# EAGLE design M162A (EAGLE 6.6.0)
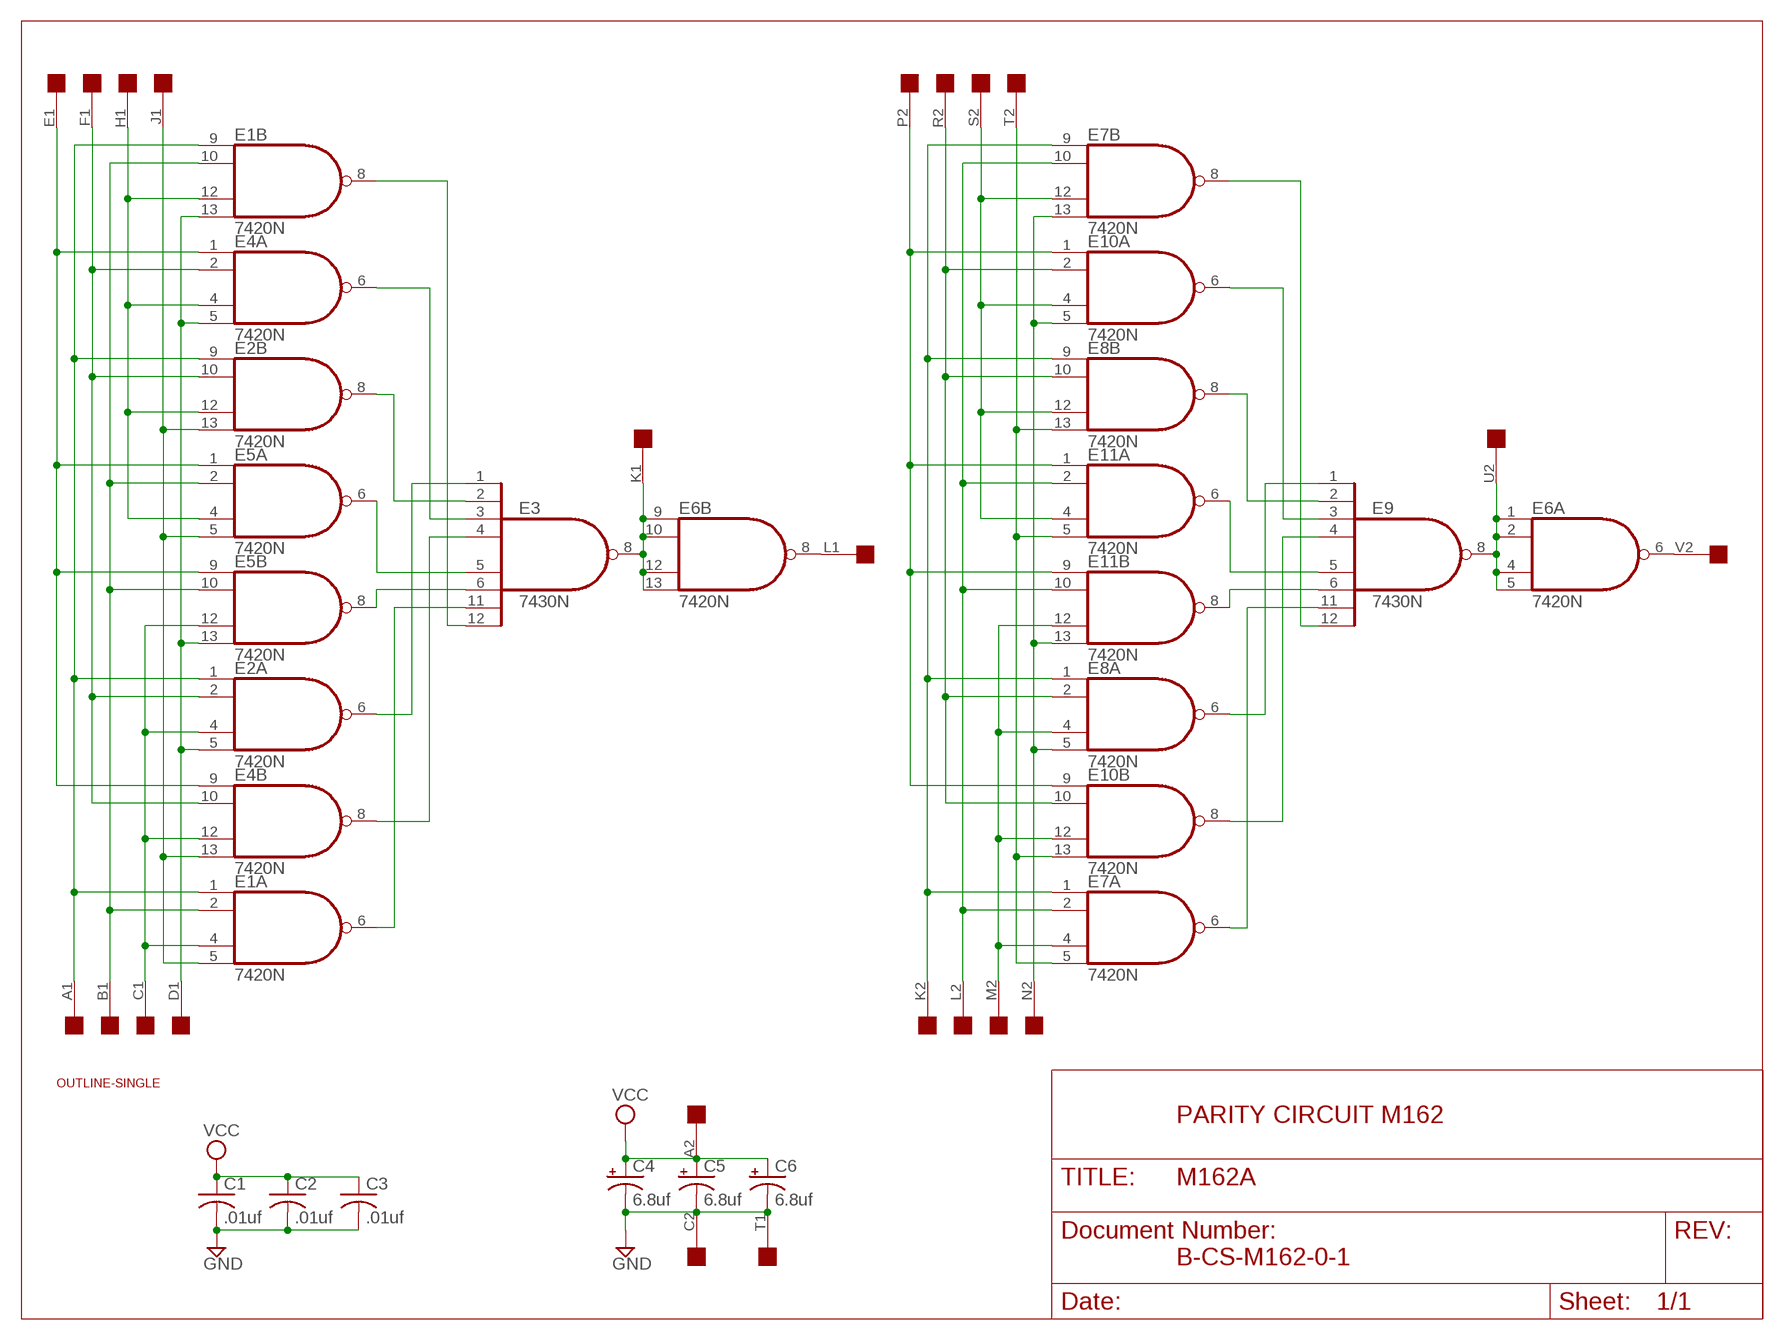
[diagram p0: schematic, sheet 1]

## Parts
C1  .01uf  C-US075-032X103  [C075-032X103]
C2  .01uf  C-US075-032X103  [C075-032X103]
C3  .01uf  C-US075-032X103  [C075-032X103]
C4  6.8uf  CPOL-USE15-5AXIAL  [E15-5]
C5  6.8uf  CPOL-USE15-5AXIAL  [E15-5]
C6  6.8uf  CPOL-USE15-5AXIAL  [E15-5]
E1  7420N  74S20N  [DIL14]
E2  7420N  74S20N  [DIL14]
E3  7430N  [DIL14]
E4  7420N  74S20N  [DIL14]
E5  7420N  74S20N  [DIL14]
E6  7420N  74S20N  [DIL14]
E7  7420N  74S20N  [DIL14]
E8  7420N  74S20N  [DIL14]
E9  7430N  [DIL14]
E10  7420N  74S20N  [DIL14]
E11  7420N  74S20N  [DIL14]
U$1  OUTLINE-SINGLE  [SINGLE]
U$2  EDGE-2CONNECTOR  [EDGE-CON2]

## Nets
GND [Supply]: C1.2 C2.2 C3.2 C4.- C5.- C6.- U$2.C2 U$2.T1
N$1: E1.4(A:I2) E2.4(A:I2) E4.12(B:I2) E5.12(B:I2) U$2.C1
N$2: E1.13(B:I3) E2.5(A:I3) E4.5(A:I3) E5.13(B:I3) U$2.D1
N$3: E3.4(I3) E4.8(B:O)
N$4: E1.12(B:I2) E2.12(B:I2) E4.4(A:I2) E5.4(A:I2) U$2.H1
N$5: E2.2(A:I1) E2.10(B:I1) E4.2(A:I1) E4.10(B:I1) U$2.F1
N$6: E1.2(A:I1) E1.10(B:I1) E5.2(A:I1) E5.10(B:I1) U$2.B1
N$7: E7.12(B:I2) E8.12(B:I2) E10.4(A:I2) E11.4(A:I2) U$2.S2
N$8: E1.1(A:I0) E1.9(B:I0) E2.1(A:I0) E2.9(B:I0) U$2.A1
N$9: E1.8(B:O) E3.12(I7)
N$10: E3.3(I2) E4.6(A:O)
N$11: E7.6(A:O) E9.11(I6)
N$12: E3.5(I4) E5.6(A:O)
N$13: E3.6(I5) E5.8(B:O)
N$14: E2.6(A:O) E3.1(I0)
N$15: E1.6(A:O) E3.11(I6)
N$16: E2.8(B:O) E3.2(I1)
N$17: E3.8(O) E6.9(B:I0) E6.10(B:I1) E6.12(B:I2) E6.13(B:I3) U$2.K1
N$18: E7.2(A:I1) E7.10(B:I1) E11.2(A:I1) E11.10(B:I1) U$2.L2
N$19: E7.13(B:I3) E8.5(A:I3) E10.5(A:I3) E11.13(B:I3) U$2.N2
N$20: E10.1(A:I0) E10.9(B:I0) E11.1(A:I0) E11.9(B:I0) U$2.P2
N$21: E8.2(A:I1) E8.10(B:I1) E10.2(A:I1) E10.10(B:I1) U$2.R2
N$24: E8.8(B:O) E9.2(I1)
N$25: E7.5(A:I3) E8.13(B:I3) E10.13(B:I3) E11.5(A:I3) U$2.T2
N$26: E7.8(B:O) E9.12(I7)
N$27: E9.3(I2) E10.6(A:O)
N$29: E9.5(I4) E11.6(A:O)
N$30: E9.6(I5) E11.8(B:O)
N$33: E9.4(I3) E10.8(B:O)
N$34: E6.1(A:I0) E6.2(A:I1) E6.4(A:I2) E6.5(A:I3) E9.8(O) U$2.U2
N$35: E6.6(A:O) U$2.V2
N$36: E6.8(B:O) U$2.L1
N$37: E1.5(A:I3) E2.13(B:I3) E4.13(B:I3) E5.5(A:I3) U$2.J1
N$86: E4.1(A:I0) E4.9(B:I0) E5.1(A:I0) E5.9(B:I0) U$2.E1
N$109: E7.4(A:I2) E8.4(A:I2) E10.12(B:I2) E11.12(B:I2) U$2.M2
N$113: E7.1(A:I0) E7.9(B:I0) E8.1(A:I0) E8.9(B:I0) U$2.K2
S$14: E8.6(A:O) E9.1(I0)
VCC [Supply]: C1.1 C2.1 C3.1 C4.+ C5.+ C6.+ U$2.A2
Unconnected: E1.3(3:NC) E1.11(11:NC) E2.3(3:NC) E2.11(11:NC) E4.3(3:NC) E4.11(11:NC) E5.3(3:NC) E5.11(11:NC) E6.3(3:NC) E6.11(11:NC) E7.3(3:NC) E7.11(11:NC) E8.3(3:NC) E8.11(11:NC) E10.3(3:NC) E10.11(11:NC) E11.3(3:NC) E11.11(11:NC) U$2.B2 U$2.D2 U$2.E2 U$2.F2 U$2.H2 U$2.J2 U$2.M1 U$2.N1 U$2.P1 U$2.R1 U$2.S1 U$2.U1 U$2.V1

## Notes on the sheet
- PARITY CIRCUIT M162
- B-CS-M162-0-1

## Power pins joined to a net without a drawn wire
GND: E1.7(P:GND) E2.7(P:GND) E3.7(GND) E4.7(P:GND) E5.7(P:GND) E6.7(P:GND) E7.7(P:GND) E8.7(P:GND) E9.7(GND) E10.7(P:GND) E11.7(P:GND)
VCC: E1.14(P:VCC) E2.14(P:VCC) E3.14(VCC) E4.14(P:VCC) E5.14(P:VCC) E6.14(P:VCC) E7.14(P:VCC) E8.14(P:VCC) E9.14(VCC) E10.14(P:VCC) E11.14(P:VCC)

## Library data of the parts
C1-C3 = rcl:C-US: CAPACITOR, American symbol
C4-C6 = dec-con:CPOL-USE15-5AXIAL: 0.6" veresion of an electrolytic
E1 E2 E4-E8 E10 E11 = dec-con:74*20: Dual 4-input NAND gate
E3 E9 = 74xx-us:74*30: 8-input NAND gate
U$1 = dec-con:OUTLINE-*: Board outlines for DEC boards.
U$2 = dec-con:EDGE-2: Double-Sided DEC edge connector.

## Net classes
1 Supply: width 0.813 mm

## Board
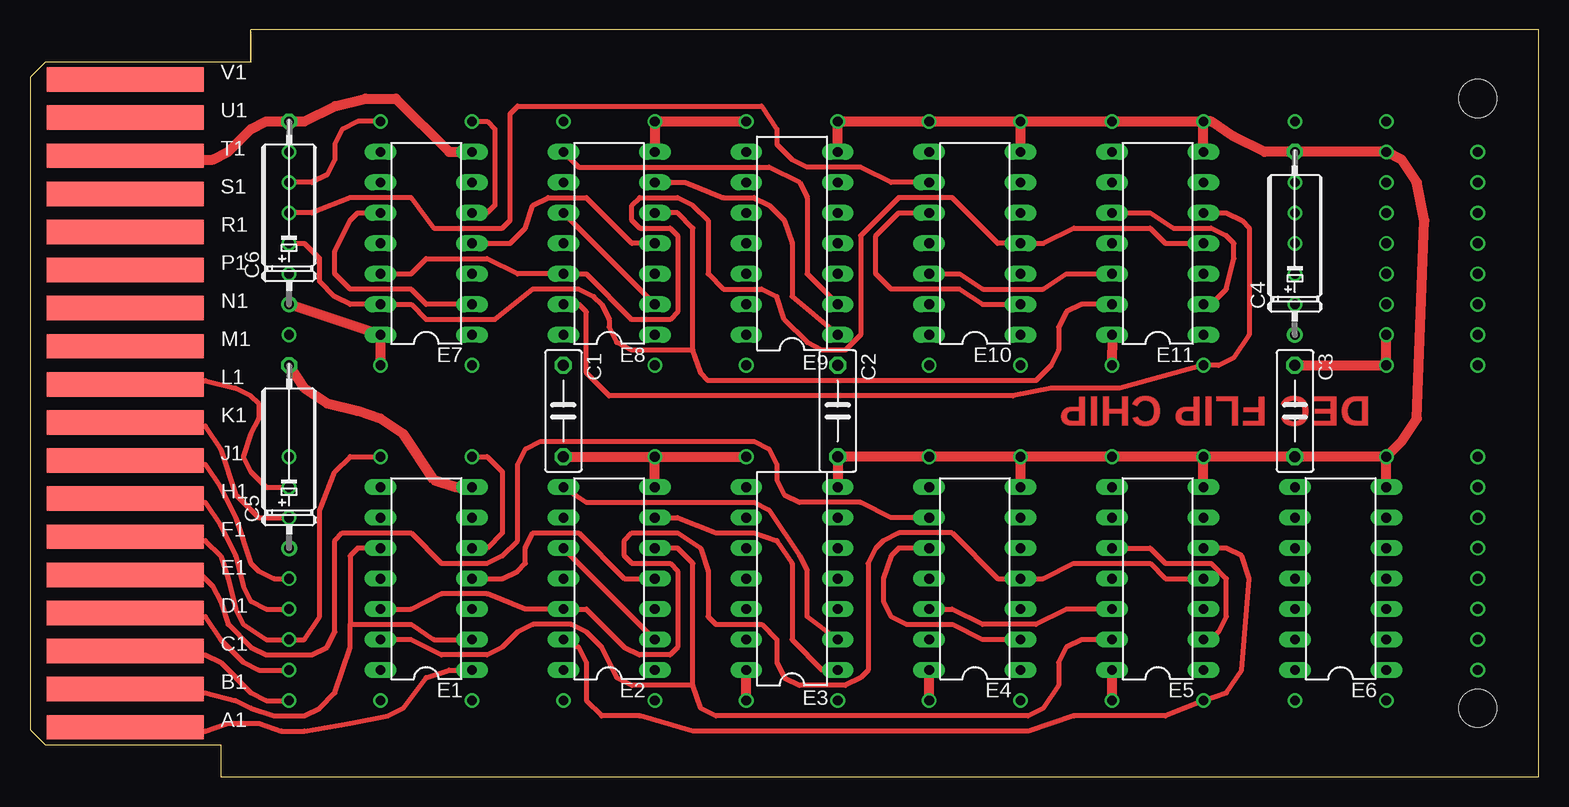
[diagram p1: board, top side]
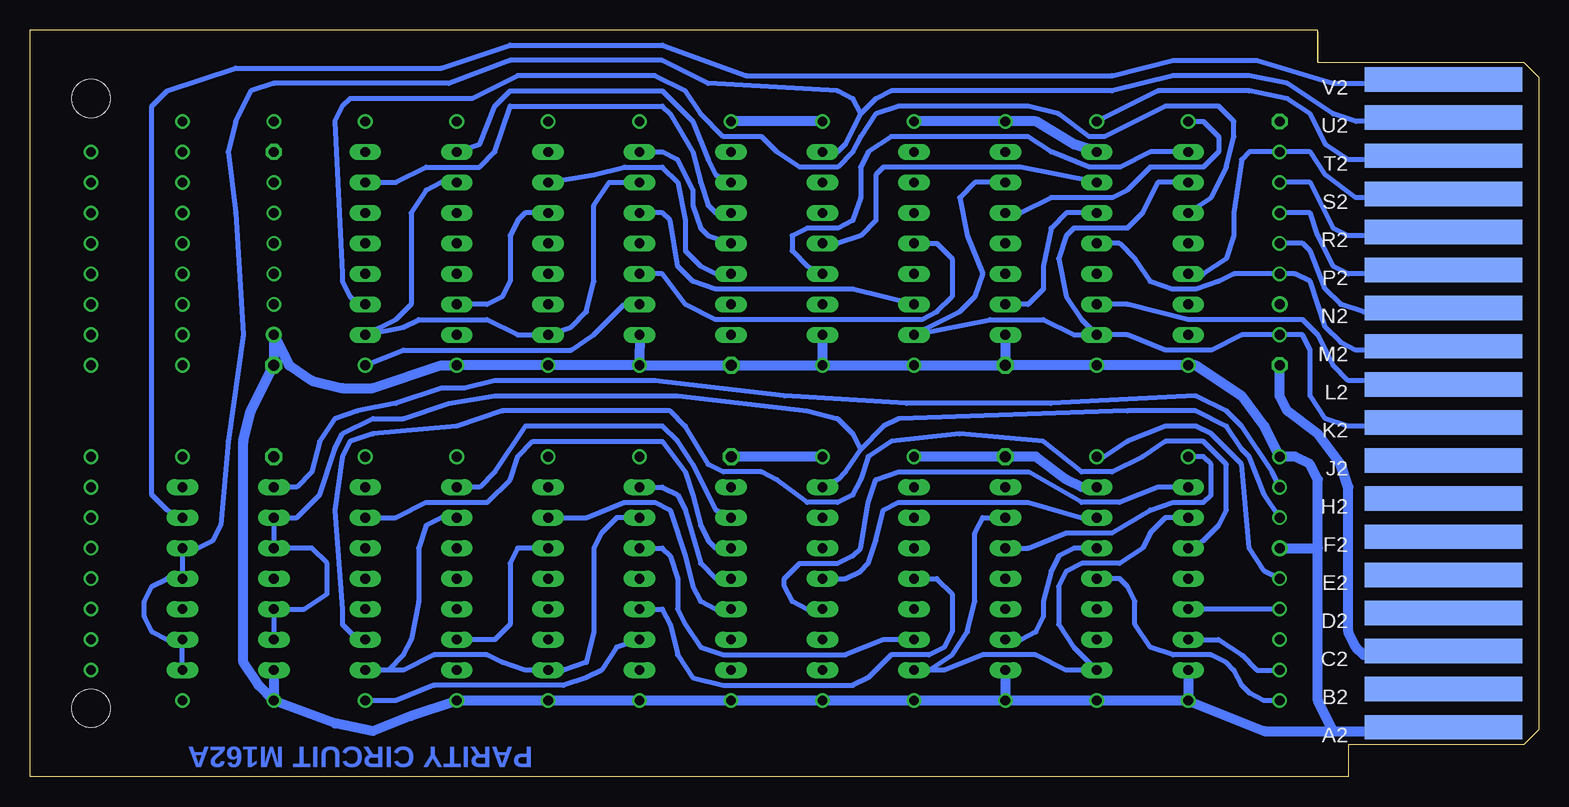
[diagram p2: board, bottom side, seen from below]

Size 125.73 x 62.23 mm. Coordinates in mm from the lower left corner, seen from the top.
Copper layers (1+16): Top 0.035mm / dielectric 1.5mm / Bottom 0.035mm
Design rules "16mils": minimum track width 16mil, minimum drill 32mil, track to track 15mil, track to pad 10mil, pad to pad 10mil, via to via 10mil, smd to smd 10mil, copper to edge 13mil, drill to drill 10mil, minimum pad ring 10mil, minimum via ring 8mil, stop-mask expansion 0mil, vias tented up to drill 0mil, thermal gap 10mil

### Footprints (pad centres in the part's own frame; a part is rotated, then mirrored left to right if it is on the bottom)
C075-032X103 = drill 0.914 octagon: 1 -3.81,0; 2 3.81,0
E15-5 = drill 0.813: + -7.62,0 | drill 0.813 octagon: - 7.62,0
DIL14 = drill 0.813 long: 1 -7.62,-3.81; 2 -5.08,-3.81; 3 -2.54,-3.81; 4 0,-3.81; 5 2.54,-3.81; 6 5.08,-3.81; 7 7.62,-3.81; 8 7.62,3.81; 9 5.08,3.81; 10 2.54,3.81; 11 0,3.81; 12 -2.54,3.81; 13 -5.08,3.81; 14 -7.62,3.81
SINGLE = hole 3.175: 120.65,56.515; 120.65,5.715
EDGE-CON2 = smd 13.106 x 2.032: A1 7.938,4.128; B1 7.938,7.303; C1 7.938,10.477; D1 7.938,13.652; E1 7.938,16.828; F1 7.938,20.003; H1 7.938,23.177; J1 7.938,26.352; K1 7.938,29.527; L1 7.938,32.703; M1 7.938,35.877; N1 7.938,39.053; P1 7.938,42.227; R1 7.938,45.403; S1 7.938,48.578; T1 7.938,51.752; U1 7.938,54.928; V1 7.938,58.102 | smd 13.106 x 2.032 bottom: A2 7.938,4.128; B2 7.938,7.303; C2 7.938,10.477; D2 7.938,13.652; E2 7.938,16.828; F2 7.938,20.003; H2 7.938,23.177; J2 7.938,26.352; K2 7.938,29.527; L2 7.938,32.703; M2 7.938,35.877; N2 7.938,39.053; P2 7.938,42.227; R2 7.938,45.403; S2 7.938,48.578; T2 7.938,51.752; U2 7.938,54.928; V2 7.938,58.102

### Placement (x,y rotation side)
C1  44.45,30.48 270 top
C2  67.31,30.48 270 top
C3  105.41,30.48 270 top
C4  105.41,44.45 90 top
C5  21.59,26.67 90 top
C6  21.59,46.99 90 top
E1  33.02,16.51 90 top
E2  48.26,16.51 90 top
E3  63.5,16.51 90 top
E4  78.74,16.51 90 top
E5  93.98,16.51 90 top
E6  109.22,16.51 90 top
E7  33.02,44.45 90 top
E8  48.26,44.45 90 top
E9  63.5,44.45 90 top
E10  78.74,44.45 90 top
E11  93.98,44.45 90 top
U$1  0,0 0 top
U$2  0,0 0 top

### Tracks (layer width: path | path; a pad name or v marks a point on that pad's centre or on a via)
GND  (via drill 0.81)
  Top 0.813: C5.- 22.86,32.38 24.77,31.11 27.31,30.48 29.21,29.84 31.12,28.57 33.66,24.77 35.56,24.13 E1.7 | C1.2 v52.07,26.67 | v52.07,26.67 v59.69,26.67 | E2.7 v52.07,26.67 | E3.7 C2.2 v74.93,26.67 v82.55,26.67 | E5.7 v97.79,26.67 | v97.79,26.67 v90.17,26.67 v82.55,26.67 | E4.7 v82.55,26.67 | E6.7 v113.03,26.67 | v113.03,26.67 C3.2 v97.79,26.67 | v113.03,26.67 114.3,27.94 115.57,29.84 116.21,46.35 115.57,49.53 114.3,51.44 v113.03,52.07 C4.- 102.87,52.07 100.33,53.34 98.43,54.61 v97.79,54.61 | E9.7 v67.31,54.61 v74.93,54.61 v82.55,54.61 | v82.55,54.61 v90.17,54.61 v97.79,54.61 | U$2.T1 9.53,51.44 15.24,51.44 16.51,52.07 18.42,53.98 19.69,54.61 C6.- 22.86,54.61 25.4,55.88 27.94,56.52 30.48,56.52 34.93,52.07 E7.7 | E8.7 v52.07,54.61 v59.69,54.61 | E10.7 v82.55,54.61 | E11.7 v97.79,54.61
  Bottom 0.813: U$2.C2 10.16,10.16 14.61,10.16 15.24,10.79 15.88,12.06 15.88,24.13 16.51,26.04 18.42,28.57 20.96,30.48 21.59,31.75 C5.- | E1.7 38.1,24.13 39.37,24.77 41.91,26.67 C1.2 v52.07,26.67 | v59.69,26.67 C2.2 | E7.7 38.74,52.7 41.91,54.61 v44.45,54.61 v52.07,54.61 | v59.69,54.61 v67.31,54.61
N$1  (via drill 0.81)
  Top 0.406: v21.59,6.35 19.69,6.35 18.42,6.99 15.88,9.53 14.61,10.16 8.89,10.16 U$2.C1 | E1.4 39.37,16.51 40.64,17.14 41.28,17.78 41.28,19.05 41.91,20.32 45.72,20.32 49.53,16.51 E2.4 | E4.12 76.84,13.97 79.38,12.7 83.82,12.7 86.36,13.97 E5.12
  Bottom 0.406: v21.59,6.35 22.86,6.35 24.13,6.99 24.77,7.62 25.4,8.89 26.04,9.53 27.31,10.16 30.48,10.16 32.39,10.79 33.66,12.7 33.66,14.61 34.29,15.88 34.93,16.51 E1.4 | E2.4 50.17,16.51 48.9,15.24 48.9,12.06 49.53,10.79 50.8,10.16 53.98,10.16 55.88,8.26 57.15,7.62 67.95,7.62 70.49,8.26 71.76,10.16 72.39,12.7 73.03,13.97 E4.12
N$2  (via drill 0.81)
  Top 0.406: E5.13 87.63,11.43 86.36,10.79 85.73,9.53 85.73,7.62 84.46,5.71 83.19,5.08 57.15,5.08 55.88,5.71 55.25,7.62 | 55.25,7.62 50.17,7.62 48.9,8.26 47.63,10.79 46.36,12.06 45.09,12.7 41.91,12.7 40.64,12.06 39.37,10.79 38.1,10.16 34.29,10.16 31.75,11.43 E1.13 | 55.25,7.62 55.25,17.78 53.98,19.05 E2.5 | v21.59,8.89 19.05,8.89 17.78,9.53 15.88,11.43 14.61,13.34 8.26,13.34 U$2.D1
  Bottom 0.406: E4.5 85.09,19.05 85.73,17.78 85.73,12.7 87,11.43 E5.13 | E1.13 26.67,11.43 24.77,10.16 23.5,8.89 v21.59,8.89
N$3
  Bottom 0.406: E4.8 73.03,24.13 71.76,23.5 71.12,22.23 69.85,17.78 68.58,16.51 E3.4
N$4  (via drill 0.81)
  Top 0.406: U$2.H1 9.53,22.86 14.61,22.86 15.88,20.95 17.15,18.41 17.78,15.88 18.42,14.61 19.69,13.97 v21.59,13.97 | E1.12 31.75,13.97 34.29,15.24 38.1,15.24 41.28,13.97 E2.12 46.36,13.97 49.53,10.79 50.8,10.16 53.34,10.16 53.98,10.79 53.98,17.14 53.34,17.78 50.17,17.78 49.53,18.41 49.53,19.68 50.17,20.32 53.98,20.32 55.88,19.05 56.52,17.14 56.52,13.34 57.15,12.7 60.96,12.7 62.23,11.43 62.23,9.53 62.87,8.26 64.14,7.62 67.95,7.62 69.22,8.26 69.85,8.89 69.85,17.78 70.49,19.05 71.12,19.68 72.39,20.32 76.84,20.32 80.65,16.51 E4.4 84.46,16.51 87,17.78 93.35,17.78 94.62,16.51 E5.4
  Bottom 0.406: v21.59,13.97 E1.12
N$5  (via drill 0.81)
  Top 0.406: U$2.F1 8.89,19.68 14.61,19.68 15.88,18.41 16.51,16.51 17.15,13.97 17.78,12.7 19.69,11.43 v21.59,11.43 22.86,11.43 24.13,13.34 24.13,22.23 25.4,25.4 26.67,26.67 v29.21,26.67 | E4.10 72.39,19.05 71.76,18.41 71.12,16.51 71.12,14.61 71.76,13.34 73.03,12.7 76.84,12.7 79.38,11.43 E4.2 | E2.10 E2.2
  Bottom 0.406: E2.10 42.55,19.05 39.37,20.32 35.56,20.32 32.39,22.23 30.48,22.86 27.94,22.86 27.31,23.5 27.31,26.04 27.94,26.67 v29.21,26.67 | E4.10 73.03,19.05 72.39,18.41 71.76,16.51 71.76,13.97 71.12,12.7 69.85,10.79 67.95,10.16 57.79,10.16 54.61,11.43 E2.2
N$6
  Top 0.406: 26.67,12.7 26.67,10.79 25.4,6.99 24.13,5.71 22.86,5.08 20.32,5.08 18.42,5.71 17.15,6.35 14.61,6.99 8.26,6.99 U$2.B1 | 26.67,12.7 31.75,12.7 33.66,11.43 E1.2 | E1.10 27.31,19.05 26.67,18.41 26.67,12.7 | E5.2 98.43,11.43 99.06,12.06 99.7,13.34 99.7,16.51 98.43,17.78 94.62,17.78 93.35,19.05 E5.10
  Bottom 0.406: E1.10 27.94,19.68 26.67,20.95 26.04,22.23 26.04,26.04 27.94,27.94 31.12,27.94 33.02,26.67 35.56,25.4 38.1,25.4 41.28,27.94 48.26,28.57 53.98,27.94 55.88,26.67 56.52,24.77 57.15,23.5 58.42,22.86 60.96,22.86 63.5,24.77 64.77,25.4 67.95,25.4 69.22,26.04 71.12,29.21 72.39,30.48 86.36,30.48 90.17,29.21 97.16,28.57 99.06,27.94 99.7,26.67 100.33,22.23 99.7,13.97 99.7,12.7 98.43,11.43 E5.2
N$7  (via drill 0.81)
  Top 0.406: E7.12 31.75,41.91 33.02,43.18 38.1,43.18 40.64,41.91 E8.12 46.36,41.91 50.17,38.1 53.34,38.1 53.98,38.73 53.98,45.09 53.34,45.72 50.8,45.72 50.17,46.35 50.17,47.62 50.8,48.26 53.98,48.26 55.25,47.62 56.52,46.35 56.52,41.91 57.79,40.64 60.96,40.64 62.23,40.01 62.87,38.1 64.77,36.2 66.04,35.56 67.95,35.56 69.22,36.83 69.22,45.09 72.39,48.26 76.84,48.26 80.65,44.45 E10.4 84.46,44.45 87,45.72 93.35,45.72 94.62,44.45 E11.4
  Bottom 0.406: U$2.S2 8.89,48.26 15.24,48.26 17.78,50.16 19.05,52.07 v21.59,52.07 24.13,52.07 24.77,51.44 25.4,46.99 25.4,45.09 26.04,43.18 27.94,41.91 E7.12
N$8
  Top 0.406: E1.1 34.93,8.89 33.02,8.26 31.12,5.71 29.85,5.08 26.67,4.45 22.86,3.81 20.96,3.81 19.05,4.45 16.51,4.45 14.61,3.81 8.26,3.81 U$2.A1
  Bottom 0.406: E1.9 31.12,21.59 32.39,20.32 33.02,19.05 34.93,17.78 38.1,17.78 39.37,17.14 40.01,15.88 40.01,12.7 38.74,10.79 E1.1 39.37,8.89 41.91,10.16 46.36,10.16 49.53,8.89 50.8,8.89 | E2.1 50.8,8.89 | 50.8,8.89 48.9,10.16 47.63,12.06 46.99,14.61 46.99,20.32 46.36,21.59 E2.9
N$9
  Bottom 0.406: E3.12 60.96,13.97 62.23,14.61 62.87,15.88 62.87,16.51 61.6,17.78 58.42,17.78 57.15,18.41 56.52,19.05 55.88,22.86 55.25,24.77 53.34,25.4 42.55,25.4 38.1,22.86 34.93,22.86 31.75,24.13 E1.8
N$10
  Bottom 0.406: E4.6 79.38,21.59 76.2,22.86 73.66,22.86 72.39,22.23 71.12,18.41 70.49,15.88 69.85,14.61 68.58,13.97 E3.3
N$11
  Bottom 0.406: E9.11 58.42,44.45 56.52,45.09 55.25,46.35 55.25,50.16 54.61,50.8 43.18,50.8 E7.6
N$12
  Bottom 0.406: E5.6 95.25,21.59 92.71,22.86 87.63,22.86 85.73,24.77 85.09,26.67 83.82,27.94 73.03,27.94 71.12,25.4 70.49,23.5 69.85,20.95 69.22,19.68 68.58,19.05 E3.5
N$13
  Bottom 0.406: E3.6 68.58,22.23 69.85,24.77 70.49,26.04 71.76,27.94 73.03,29.21 84.46,29.21 87,25.4 88.27,24.13 E5.8
N$14
  Top 0.406: E2.6 53.98,21.59 57.15,20.32 60.33,20.32 62.23,19.68 63.5,17.78 63.5,11.43 66.04,8.89 E3.1
N$15
  Bottom 0.406: E3.11 57.79,16.51 56.52,17.14 55.88,17.78 55.25,19.68 54.61,22.23 53.34,22.86 42.55,22.86 38.1,21.59 E1.6
N$16
  Top 0.406: E2.8 46.36,22.86 60.33,22.86 61.6,22.23 64.14,18.41 64.77,17.14 64.77,13.34 E3.2
N$17  (via drill 0.81)
  Top 0.406: U$2.K1 10.16,29.21 14.61,29.21 15.88,27.3 17.15,23.5 19.05,21.59 v21.59,21.59
  Bottom 0.406: v21.59,21.59 22.86,23.5 24.13,26.67 24.77,27.3 26.04,29.21 28.58,30.48 34.29,30.48 53.34,29.84 54.61,29.21 56.52,27.3 | 56.52,27.3 57.79,25.4 58.42,24.77 E3.8 | 56.52,27.3 57.15,28.57 58.42,29.84 60.96,30.48 71.76,31.75 87,31.75 90.81,31.11 94.62,29.84 97.16,29.84 99.7,28.57 100.33,27.3 101.6,23.5 103.51,21.59 E6.9 E6.10 102.24,19.05 100.97,17.78 100.97,15.24 102.87,13.97 E6.12 E6.13
N$18
  Top 0.406: E11.2 98.43,39.37 99.7,40.64 100.33,43.18 100.33,44.45 99.7,45.09 98.43,45.72 95.25,45.72 93.35,46.99 E11.10 | E7.10 27.31,46.99 26.67,46.35 25.4,43.81 25.4,41.91 26.67,40.64 31.75,40.64 33.02,39.37 E7.2
  Bottom 0.406: E7.10 27.31,48.26 26.04,50.8 25.4,53.34 25.4,54.61 26.67,55.88 31.12,55.88 36.2,53.34 37.47,53.34 40.01,55.24 42.55,55.88 53.34,55.88 55.25,55.24 56.52,53.34 57.15,52.07 58.42,50.8 61.6,50.8 63.5,52.07 64.77,53.34 67.95,53.34 69.85,55.24 71.12,57.15 73.66,58.42 85.09,58.42 88.9,56.52 99.06,56.52 99.7,55.88 100.33,54.61 99.7,41.91 99.7,41.27 99.06,40.01 98.43,39.37 E11.2 | U$2.L2 8.89,33.02 15.88,33.02 17.15,34.29 18.42,36.83 19.69,38.1 29.21,38.1 34.29,39.37 E7.2
N$19  (via drill 0.81)
  Top 0.406: v21.59,44.45 22.86,44.45 24.13,43.18 24.13,41.27 25.4,40.01 26.67,39.37 E7.13 31.75,39.37 33.02,38.1 38.74,38.1 41.91,40.64 45.72,40.64 46.99,40.01 47.63,39.37 48.26,38.1 48.26,37.47 48.9,36.2 50.17,35.56 55.25,35.56 | E11.13 87.63,39.37 86.36,38.73 85.73,37.47 85.73,35.56 85.09,34.29 83.82,33.02 56.52,33.02 55.88,33.66 55.25,35.56 | 55.25,35.56 55.25,45.72 53.98,46.99 E8.5
  Bottom 0.406: U$2.N2 8.89,38.73 14.61,38.73 16.51,39.37 17.78,40.64 19.05,43.81 19.69,44.45 v21.59,44.45 | E10.5 84.46,46.99 85.09,46.35 85.73,45.09 85.73,41.27 86.36,40.01 87.63,39.37 E11.13
N$20  (via drill 0.81)
  Top 0.406: E10.9 71.76,49.53 69.22,50.8 64.77,50.8 63.5,51.44 62.23,52.7 62.23,53.98 60.96,55.88 40.64,55.88 40.01,55.24 40.01,46.35 39.37,45.72 33.66,45.72 31.75,48.26 26.67,48.26 23.5,46.99 v21.59,46.99
  Bottom 0.406: E11.9 91.44,49.53 92.71,48.9 93.98,46.99 93.98,39.37 95.25,38.1 E11.1 94.62,37.47 93.35,38.1 87.63,38.1 85.09,36.83 E10.1 80.65,37.47 79.38,38.73 78.74,41.27 78.74,47.62 77.47,49.53 E10.9 | U$2.P2 8.89,41.91 15.88,41.91 17.15,42.55 18.42,45.09 19.05,46.99 v21.59,46.99
N$21  (via drill 0.81)
  Top 0.406: v29.21,54.61 27.31,54.61 26.04,53.98 25.4,52.7 25.4,51.44 24.77,50.16 23.5,49.53 v21.59,49.53 | E10.10 72.39,46.99 70.49,45.09 70.49,41.91 71.76,40.64 77.47,40.64 79.38,39.37 E10.2 | E8.2 E8.10
  Bottom 0.406: v29.21,54.61 27.94,54.61 26.67,53.34 26.67,52.07 27.94,50.8 32.39,50.8 34.29,48.9 35.56,48.26 40.64,48.26 43.18,46.99 E8.10 | U$2.R2 8.89,45.09 15.88,45.09 17.15,45.72 19.05,49.53 v21.59,49.53 | E8.2 57.15,40.64 68.58,40.64 70.49,41.27 71.76,42.55 72.39,46.35 73.03,46.99 E10.10
N$24
  Top 0.406: E8.8 45.72,50.8 61.6,50.8 64.14,49.53 64.77,48.26 64.77,41.91 E9.2
N$25  (via drill 0.81)
  Top 0.406: v36.83,54.61 38.1,54.61 38.74,53.98 38.74,47.62 38.1,46.99 E7.5 | E11.5 99.7,46.99 100.97,46.35 101.6,45.72 101.6,36.83 100.33,34.92 99.06,34.29 v97.79,34.29 90.81,32.38 85.09,32.38 81.92,31.75 48.26,31.75 46.36,33.66 46.36,38.73 45.72,39.37 E8.13
  Bottom 0.406: E7.5 39.37,46.99 40.64,45.72 41.28,42.55 41.28,40.64 42.55,39.37 E8.13 | U$2.T2 9.53,51.44 15.88,51.44 17.78,52.7 19.05,55.24 20.96,56.52 24.13,57.15 31.75,57.15 v36.83,54.61 | v97.79,34.29 94.62,35.56 80.65,35.56 78.74,36.83 76.2,39.37 E10.13
N$26
  Bottom 0.406: E7.8 32.39,52.07 34.93,50.8 37.47,50.8 40.64,52.07 42.55,53.34 53.98,53.34 55.88,52.07 56.52,50.8 56.52,48.26 57.15,46.35 58.42,45.72 60.96,45.72 62.23,45.09 62.23,43.81 60.96,42.55 E9.12
N$27
  Bottom 0.406: E10.6 78.74,50.16 76.2,50.8 73.03,50.8 71.76,49.53 71.12,46.35 71.12,43.81 69.85,42.55 68.58,41.91 E9.3
N$29
  Bottom 0.406: E11.6 95.25,49.53 92.71,50.8 88.27,50.8 87,52.07 85.73,55.88 73.03,55.88 72.39,55.24 70.49,52.07 69.85,49.53 69.22,47.62 68.58,46.99 E9.5
N$30
  Bottom 0.406: E11.8 88.27,52.7 87,55.88 85.73,57.15 73.03,57.15 70.49,54.61 69.22,51.44 68.58,50.16 E9.6
N$33
  Bottom 0.406: E10.8 73.03,52.07 71.76,51.44 70.49,48.9 70.49,47.62 69.85,45.72 69.22,45.09 E9.4
N$34
  Bottom 0.406: E6.1 E6.2 114.3,11.43 115.57,12.06 116.21,13.34 116.21,14.61 115.57,15.88 114.3,16.51 E6.4 E6.5 111.76,19.05 110.49,19.68 109.86,20.95 109.22,27.94 107.95,36.83 108.59,46.99 109.22,52.07 108.59,54.61 107.32,57.15 105.41,57.78 90.81,57.78 85.73,59.69 73.03,59.69 69.22,57.78 58.42,57.15 57.15,56.52 56.52,55.24 | U$2.U2 8.89,54.61 15.24,54.61 17.15,55.24 20.96,57.78 24.13,58.42 30.48,58.42 35.56,57.15 53.98,57.15 55.25,56.52 56.52,55.24 | 56.52,55.24 57.79,52.7 58.42,52.07 E9.8
N$35
  Bottom 0.406: E6.6 114.3,22.23 115.57,23.5 115.57,55.88 114.3,57.15 108.59,59.05 91.44,59.05 85.73,60.96 73.03,60.96 66.04,58.42 35.56,58.42 30.48,59.69 23.5,59.69 17.15,57.78 8.89,57.78 U$2.V2
N$36  (via drill 0.81)
  Top 0.406: U$2.L1 10.16,33.02 14.61,33.02 17.15,32.38 18.42,31.75 19.05,31.11 19.05,29.84 18.42,28.57 17.78,26.67 18.42,25.4 19.69,24.13 v21.59,24.13
  Bottom 0.406: v21.59,24.13 22.23,25.4 24.77,29.21 26.04,30.48 28.58,31.75 40.64,31.11 52.71,31.11 62.87,31.75 73.66,33.02 87,33.02 89.54,32.38 91.44,32.38 95.25,31.11 98.43,30.48 100.33,29.84 101.6,27.94 102.24,25.4 103.51,24.13 E6.8
N$37  (via drill 0.81)
  Top 0.406: U$2.J1 8.89,26.04 14.61,26.04 15.88,24.13 17.15,21.59 18.42,17.78 19.05,17.14 20.32,16.51 v21.59,16.51 | v36.83,26.67 38.1,26.67 39.37,25.4 39.37,20.32 38.1,19.05 E1.5 | E5.5 99.7,19.05 100.97,18.41 101.6,16.51 100.97,8.89 99.7,6.99 v97.79,6.35 94.62,5.08 87,5.08 83.19,3.81 55.25,3.81 50.8,5.08 47.63,5.08 46.36,6.35 46.36,9.53 45.72,10.79 E2.13
  Bottom 0.406: E1.5 38.74,19.05 40.01,18.41 40.64,17.14 41.28,14.61 41.28,13.34 41.91,12.06 43.18,11.43 E2.13 | v21.59,16.51 22.86,17.14 24.13,19.05 24.77,26.04 27.31,28.57 28.58,29.21 31.12,29.21 34.29,27.94 36.2,26.67 v36.83,26.67 | E4.13 76.84,10.79 78.11,8.89 79.38,8.26 81.28,7.62 92.08,7.62 95.25,6.35 v97.79,6.35
N$57  (via drill 0.81)
  other vias: 113.03,39.37
N$58  (via drill 0.81)
  other vias: 113.03,41.91
N$59  (via drill 0.81)
  other vias: 113.03,44.45
N$60  (via drill 0.81)
  other vias: 113.03,46.99
N$61  (via drill 0.81)
  other vias: 113.03,49.53
N$62  (via drill 0.81)
  other vias: 105.41,39.37
N$63  (via drill 0.81)
  other vias: 105.41,41.91
N$64  (via drill 0.81)
  other vias: 105.41,44.45
N$65  (via drill 0.81)
  other vias: 105.41,46.99
N$66  (via drill 0.81)
  other vias: 105.41,49.53
N$67  (via drill 0.81)
  other vias: 105.41,54.61
N$68  (via drill 0.81)
  other vias: 113.03,54.61
N$70  (via drill 0.81)
  other vias: 120.65,8.89
N$71  (via drill 0.81)
  other vias: 120.65,11.43
N$72  (via drill 0.81)
  other vias: 120.65,13.97
N$73  (via drill 0.81)
  other vias: 120.65,16.51
N$74  (via drill 0.81)
  other vias: 120.65,19.05
N$75  (via drill 0.81)
  other vias: 120.65,21.59
N$76  (via drill 0.81)
  other vias: 120.65,24.13
N$77  (via drill 0.81)
  other vias: 120.65,26.67
N$78  (via drill 0.81)
  other vias: 120.65,34.29
N$79  (via drill 0.81)
  other vias: 120.65,36.83
N$80  (via drill 0.81)
  other vias: 120.65,39.37
N$81  (via drill 0.81)
  other vias: 120.65,41.91
N$82  (via drill 0.81)
  other vias: 120.65,44.45
N$83  (via drill 0.81)
  other vias: 120.65,46.99
N$84  (via drill 0.81)
  other vias: 120.65,52.07
N$85  (via drill 0.81)
  other vias: 120.65,49.53
N$86
  Top 0.406: U$2.E1 8.26,17.14 13.97,17.14 15.24,15.88 15.88,14.61 16.51,12.7 18.42,10.79 19.69,10.16 23.5,10.16 24.77,10.79 25.4,12.06 25.4,19.68 26.04,20.32 31.75,20.32 34.29,17.78 38.1,17.78 39.37,18.41 40.64,19.68 40.64,26.04 41.28,27.3 42.55,27.94 60.33,27.94 61.6,27.3 62.23,26.04 62.23,24.77 62.87,23.5 64.14,22.86 69.22,22.86 71.76,21.59 E4.9
  Bottom 0.406: 95.89,8.89 94.62,8.89 92.08,10.16 87.63,10.16 86.36,9.53 84.46,8.89 E4.1 81.28,8.89 79.38,9.53 78.74,12.06 78.74,19.05 78.11,20.32 76.84,21.59 E4.9 | 95.89,8.89 E5.1 | E5.9 91.44,21.59 92.71,20.95 93.35,19.05 93.35,14.61 93.98,11.43 94.62,10.16 95.89,8.89
N$109  (via drill 0.81)
  Top 0.406: E11.12 86.36,41.91 84.46,40.64 79.38,40.64 77.47,41.91 E10.12 | E7.4 40.01,44.45 41.28,45.72 41.91,47.62 43.18,48.26 46.36,48.26 50.17,44.45 E8.4
  Bottom 0.406: U$2.M2 8.89,35.56 15.24,35.56 16.51,36.2 17.78,37.47 19.05,41.27 20.32,41.91 v21.59,41.91 25.4,41.91 26.67,41.27 28.58,40.64 30.48,40.64 32.39,41.27 33.66,43.18 34.93,44.45 E7.4 | E8.4 50.17,44.45 48.9,43.18 48.9,40.01 50.17,38.73 51.44,38.1 68.58,38.1 71.12,39.37 73.03,41.91 74.3,41.91 E10.12
N$113  (via drill 0.81)
  Bottom 0.406: U$2.K2 8.89,29.21 15.88,29.21 17.78,29.84 19.05,31.75 19.05,35.56 19.69,36.83 v21.59,36.83 24.77,36.83 27.31,35.56 31.12,35.56 34.29,36.83 E7.1 | E7.9 31.75,49.53 33.02,46.99 34.29,45.72 38.74,45.72 39.37,45.09 40.01,43.18 39.37,40.01 38.1,38.1 E7.1 | E7.1 38.74,36.83 41.28,38.1 45.72,38.1 E8.1 48.26,38.73 46.99,40.01 46.36,41.91 47.63,45.09 48.26,48.26 46.99,49.53 E8.9
S$1  (via drill 0.81)
  other vias: 113.03,6.35
S$14
  Top 0.406: E8.6 54.61,49.53 57.79,48.26 60.33,48.26 61.6,47.62 62.87,46.35 63.5,44.45 63.5,40.01 E9.1
VCC  (via drill 0.81)
  Top 0.813: v29.21,34.29 E7.14 C6.+ | E11.14 90.16,34.31 v90.17,34.29 | C3.1 v113.03,34.29 v113.03,36.83 | v59.69,6.35 E3.14 | v74.93,6.35 E4.14 | v90.17,6.35 E5.14
  Bottom 0.813: E1.14 v29.21,6.35 | v29.21,6.35 22.86,3.81 17.15,3.81 | 17.15,3.81 8.89,3.81 U$2.A2 | 17.15,3.81 18.42,6.35 18.42,19.05 | 18.42,19.05 18.42,24.77 19.05,26.04 20.32,26.67 v21.59,26.67 22.86,29.21 24.77,31.75 28.58,34.29 v29.21,34.29 v36.83,34.29 C1.1 | C5.+ 18.42,19.05 | E8.14 C1.1 | v74.93,34.29 C2.1 v59.69,34.29 | E10.14 74.94,34.5 v74.93,34.29 | v59.69,34.29 v52.07,34.29 C1.1 | E9.14 v59.69,34.29 | E6.14 v105.41,6.35 | v105.41,6.35 106.68,7.62 107.95,9.53 107.95,27.94 107.32,30.48 C3.1 C4.+ 104.14,34.29 102.24,33.02 99.7,32.38 97.16,32.38 91.44,34.29 v90.17,34.29 v82.55,34.29 v74.93,34.29 | E2.14 v44.45,6.35 | v44.45,6.35 v52.07,6.35 v59.69,6.35 v67.31,6.35 v74.93,6.35 v82.55,6.35 v90.17,6.35 93.98,5.08 97.16,3.81 100.33,4.45 v105.41,6.35 | v29.21,6.35 v36.83,6.35 v44.45,6.35

### Text on the board
Top: DEC FLIP CHIP
Bottom: PARITY CIRCUIT M162A